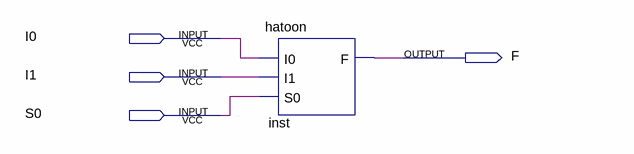
[diagram p0: schematic sheet]
// Quartus schematic hatoonIM.bdf as structural Verilog: 1 symbols, 4 pins
module hatoonIM (
  input  I0,
  input  I1,
  input  S0,
  output F
);

  hatoon inst (.I0(I0), .I1(I1), .S0(S0), .F(F));
endmodule
